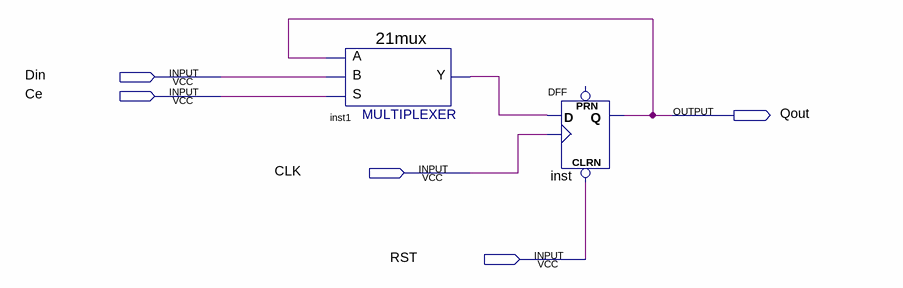
[diagram p0: schematic sheet]
// Quartus schematic ex2.bdf as structural Verilog: 2 symbols, 5 pins
module ex2 (
  input  Din,
  input  Ce,
  input  CLK,
  input  RST,
  output Qout
);

  wire inst1_y;

  \21mux  inst1 (.S(Ce), .B(Din), .A(Qout), .Y(inst1_y));
  DFF inst (.CLRN(RST), .CLK(CLK), .D(inst1_y), .Q(Qout));  // open: PRN
endmodule
